# Altium schematic sheet Motorvezerlo.SchDoc
size A4
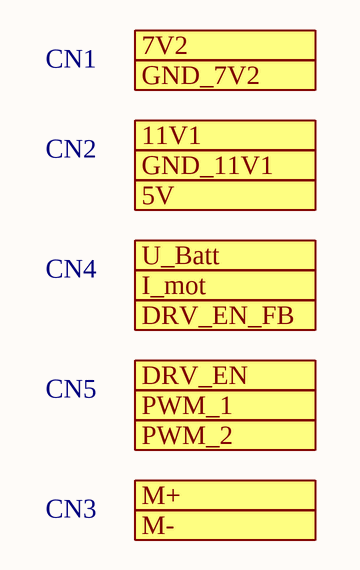
[diagram p0: Motorvezerlo.SchDoc]

## Ports
5V (out), 7V2 (in), 11V1 (in), DRV_EN (in), DRV_EN_FB (out), GND_7V2 (in), GND_11V1 (in), I_mot (out), M+ (out), M- (out), PWM_1 (in), PWM_2 (in), U_Batt (out)

## Notes on the sheet
- CN1
- CN2
- CN4
- CN5
- CN3